# Altium schematic sheet UKU208_power_board.SchDoc
size A3
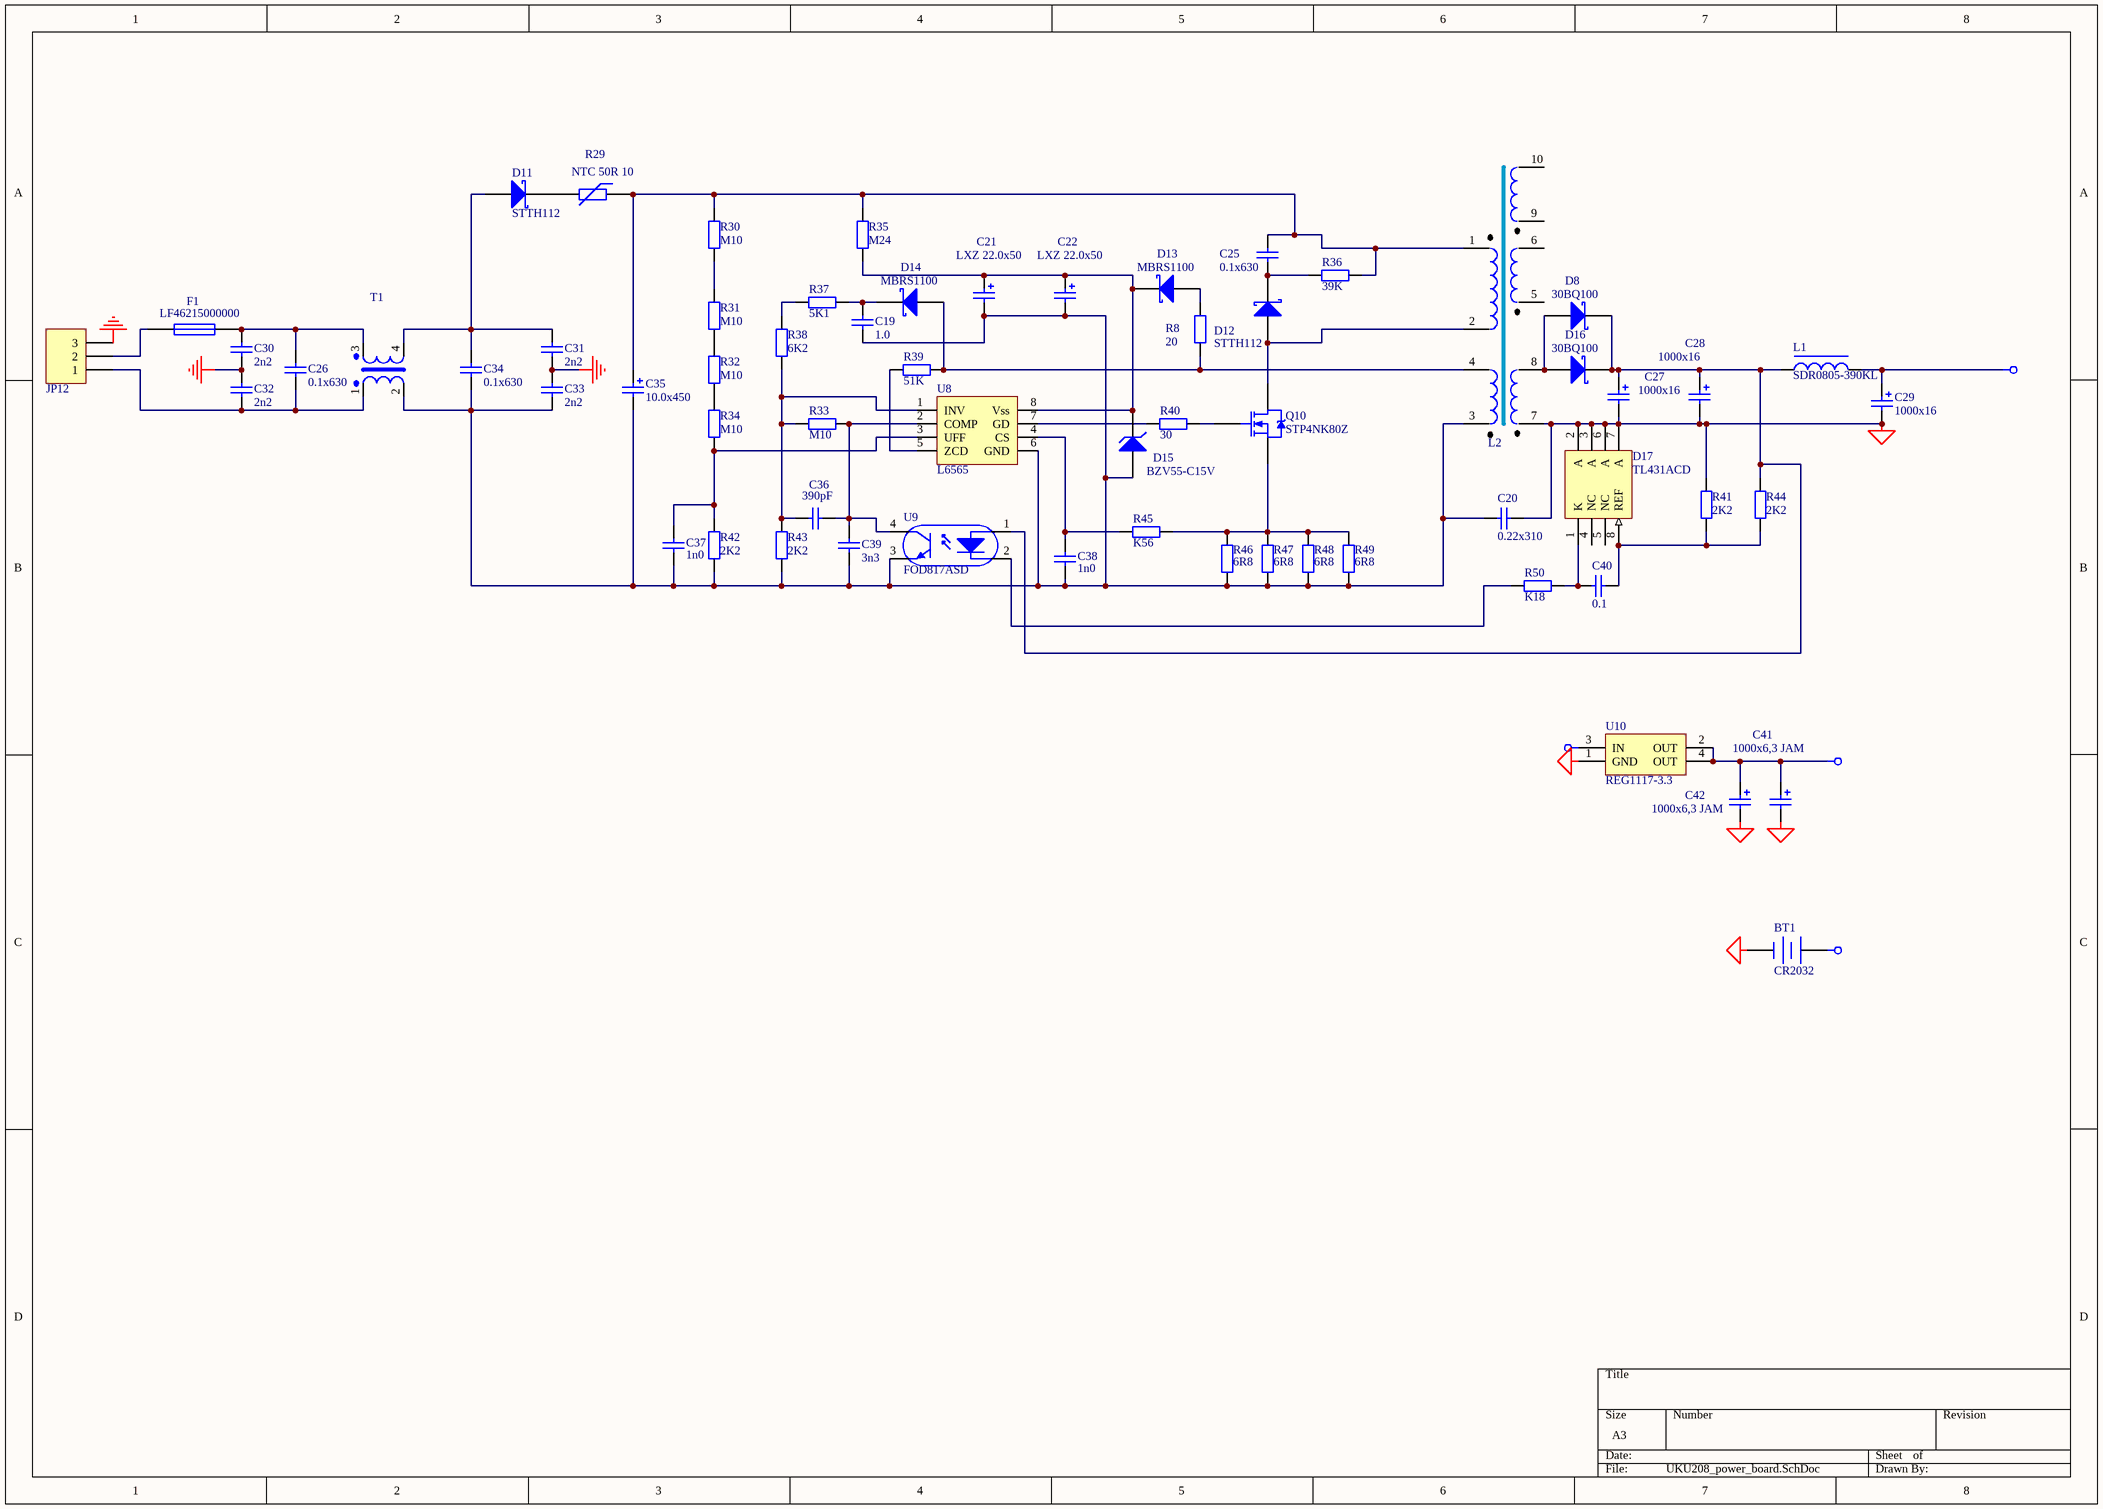
[diagram p0: UKU208_power_board.SchDoc]

## Parts
BT1  CR2032  [BAT_SUPP]
C19  1.0  [_1206]
C20  0.22x310  [C8]
C21  LXZ 22.0x50  [el3]
C22  LXZ 22.0x50  [el3]
C25  0.1x630  [c15]
C26  0.1x630  [c15]
C27  1000x16  [el5]
C28  1000x16  [el5]
C29  1000x16  [el5]
C30  2n2  [C8]
C31  2n2  [c8]
C32  2n2  [c8]
C33  2n2  [c8]
C34  0.1x630  [c15]
C35  10.0x450  [el_15_25_h]
C36  390pF  [_1206]
C37  1n0  [_1206]
C38  1n0  [_1206]
C39  3n3  [_1206]
C40  0.1  [_1206]
C41  1000x6,3 JAM  [el3]
C42  1000x6,3 JAM  [el3]
D8  30BQ100  [30BQ100]
D11  STTH112  [D_6_3]
D12  STTH112  [D_6_3]
D13  MBRS1100  [D_6_3]
D14  MBRS1100  [D_6_3]
D15  BZV55-C15V  [_1206d]
D16  30BQ100  [30BQ100]
D17  TL431ACD  [SO-G8]
F1  LF46215000000  [LF462]
JP12  Header 3  [2EDGR-5.08-3P]  (value not drawn)
L1  SDR0805-390KL  [L10x10]
L2  L220-K10  [trans_ring1]  (value not drawn)
Q10  STP4NK80Z  [TO220_h]
R8  20  [_1206]
R29  NTC 50R 10  [JVR07N]
R30  M10  [_1206]
R31  M10  [_1206]
R32  M10  [_1206]
R33  M10  [_1206]
R34  M10  [_1206]
R35  M24  [AXIAL-0.7]
R36  39K  [AXIAL-0.7]
R37  5K1  [_1206]
R38  6K2  [_1206]
R39  51K  [_1206]
R40  30  [_1206]
R41  2K2  [_1206]
R42  2K2  [_1206]
R43  2K2  [_1206]
R44  2K2  [_1206]
R45  K56  [_1206]
R46  6R8  [_1206]
R47  6R8  [_1206]
R48  6R8  [_1206]
R49  6R8  [_1206]
R50  K18  [_1206]
T1  TRANS1_1  [3030R4]  (value not drawn)
U8  L6565  [so-g8]
U9  FOD817ASD  [FOD817ASD]
U10  REG1117-3.3  [DSO-G3]

## Nets
+3v3: C41.1 C42.1 U10.2(OUT) U10.4(OUT)
+5v: C29.1 L1.2 U10.3(IN)
+Vbat: BT1.1(+)
GND: BT1.2(-) C20.1 C27.2 C28.2 C29.2 C41.2 C42.2 D17.2(A) D17.3(A) D17.6(A) D17.7(A) L2.7 R41.2 U10.1(GND)
GND_GND: C30.1 C31.1 C32.2 C33.2 JP12.3
NetC19_1: C19.1 C20.2 C21.2 C22.2 C33.1 C34.1 C35.2 C37.2 C38.2 C39.1 D15.1(A) L2.3 R42.1 R43.1 R46.2 R47.2 R48.2 R49.2 T1.2(Pri-) U8.6(GND) U9.3
NetC19_2: C19.2 D14.2(K) R37.1
NetC21_1: C21.1 C22.1 D13.2(K) D15.2(K) R35.1 U8.8(Vss)
NetC25_1: C25.1 D12.2(K) R36.2
NetC25_2: C25.2 C35.1 L2.1 R29.1 R30.2 R35.2 R36.1
NetC26_1: C26.1 C32.1 JP12.1 T1.1(Pri+)
NetC26_2: C26.2 C30.2 F1.1 T1.3(Sec1+)
NetC27_1: C27.1 C28.1 D8.2(K) D16.2(K) L1.1 R44.1 U9.1
NetC31_2: C31.2 C34.2 D11.1(A) T1.4(Sec1-)
NetC36_1: C36.1 R33.2 R38.1 R43.2 U8.1(INV)
NetC36_2: C36.2 C39.2 R33.1 U8.2(COMP) U9.4
NetC37_1: C37.1 R34.1 R42.2 U8.3(UFF)
NetC38_1: C38.1 R45.2 U8.4(CS)
NetC40_1: C40.1 D17.8(REF) R41.1 R44.2
NetC40_2: C40.2 D17.1(K) R50.1
NetD8_1: D8.1(A) D16.1(A) L2.8
NetD11_2: D11.2(K) R29.2
NetD12_1: D12.1(A) L2.2 Q10.2(D)
NetD13_1: D13.1(A) R8.1
NetD14_1: D14.1(A) L2.4 R8.2 R39.1
NetF1_2: F1.2 JP12.2
NetQ10_1: Q10.1(G) R40.1
NetQ10_3: Q10.3(S) R45.1 R46.1 R47.1 R48.1 R49.1
NetR30_1: R30.1 R31.2
NetR31_1: R31.1 R32.2
NetR32_1: R32.1 R34.2
NetR37_2: R37.2 R38.2
NetR39_2: R39.2 U8.5(ZCD)
NetR40_2: R40.2 U8.7(GD)
NetR50_2: R50.2 U9.2

Not connected (* = marked no-connect by the designer): D17 4(NC) 5(NC); L2 5 6 9 10

## Library data of the parts
BT1 = Battery: Multicell Battery; Manufacturer: Generic Components; Published: 24-Mar-1999; Revision: July-2002: Re-released for DXP Platform.; Publisher: Altium Limited
C19 C20 C25 C26 C30-C34 C36-C40 = Cap Semi: Capacitor (Semiconductor SIM Model); Manufacturer: Generic Components; Class I: Passive; Value: 1,0; Published: 8-Jun-2000; Revision: July-2002: Re-released for DXP Platform.; Publisher: Altium Limited; Class II: Capacitor
C21 C22 C27-C29 C35 C41 C42 = Cap Pol1: Polarized Capacitor (Radial); Manufacturer: Generic Components; Class I: Passive; Value: 22,0x50; Published: 8-Jun-2000; Revision: July-2002: Re-released for DXP Platform.; Publisher: Altium Limited; Class II: Capacitor
D8 D13 D14 D16 = 10BQ015: Schottky Rectifier; Manufacturer: International Rectifier; Revision 1: 10-July-2000: SIM Model Added.; Revision 2: July-2002: Re-released for DXP Platform.; Class I: Discrete; Class II: Rectifier - Schottky; Published: 8-Jun-2000; Datasheet: Latest Revision: PD-2.396A; Package Reference: DO-214AA; Publisher: Altium Limited
D11 D12 = 10BQ015: Schottky Diode; Manufacturer: International Rectifier; Revision 1: 10-July-2000: SIM Model Added.; Revision 2: July-2002: Re-released for DXP Platform.; Class I: Discrete; Class II: Rectifier - Schottky; Value: 10BQ100; Published: 8-Jun-2000; Datasheet: Latest Revision: PD-2.396A; Package Reference: DO-214AA; Publisher: Altium Limited
D15 = D Zener: Zener Diode; Manufacturer: Generic Components; Class I: Discrete; Class II: Diode - Zener; Value: BZV55C5V6; Published: 8-Jun-2000; Revision: July-2002: Re-released for DXP Platform.; Publisher: Altium Limited
D17 = TL431ACD: Programmable Precision Reference; Manufacturer: Motorola; Class I: Power Management; Class II: Voltage Reference; Published: 15-Apr-2002; Datasheet: Linear and Interface Integrated Circuits, DL128 Rev2 (1988); Package Reference: 751-02; Publisher: Altium Limited
F1 = Fuse 1: Fuse; Manufacturer: Generic Components; Class I: Passive; Published: 8-Jun-2000; Revision: July-2002: Re-released for DXP Platform.; Publisher: Altium Limited; Class II: Fuse
JP12 = Header 3: Header, 3-Pin; Manufacturer: Generic Components; Class I: Connector; Revision: July-2002: Re-released for DXP Platform.; Publisher: Altium Limited
L1 = Inductor Konstr 2: Magnetic-Core Inductor; Manufacturer: Generic Components; Class I: Passive; Published: 24-Mar-1999; Revision: July-2002: Re-released for DXP Platform.; Publisher: Altium Limited; Class II: Inductor
L2 = L1_dc_2: Дроссель
Q10 = NMOS-2: N-Channel Power MOSFET; Manufacturer: Generic Components; Class I: Discrete; Class II: MOSFET - Power; Note: Pin 2 is electrically connected to pin 4.; Published: 8-Jun-2000; Revision: July-2002: Re-released for DXP Platform.; Datasheet: Latest Revision: PD-9.814; Package Reference: TO-220AB; Publisher: Altium Limited
R8 R30-R50 = Res2: Resistor; Manufacturer: Generic Components; Class I: Passive; Value: 1K0; Rule: Undefined; Published: 8-Jun-2000; Revision: July-2002: Re-released for DXP Platform.; Publisher: Altium Limited; Class II: Resistor
R29 = Res Varistor: Varistor (Voltage-Sensitive Resistor); Manufacturer: Generic Components; Class I: Discrete; Published: 24-Mar-1999; Revision: July-2002: Re-released for DXP Platform.; Publisher: Altium Limited; Class II: Voltage-Sensitive Resistor
T1 = TRANS1_1: Manufacturer: Generic Components; Class I: Passive; Class II: Transformer; Published: 25-Jan-2001; Revision: July-2002: Re-released for DXP Platform.; Publisher: Altium Limited
U9 = F00817ASD
U10 = REG1117-3.3: 800mA and 1A Low Dropout Positive Regulator 2.85V, 3.3V, 5V, and Adjustable; Manufacturer: Burr-Brown; Package Information: Latest Revision: Rev. C; Class I: Power Management; Class II: Voltage Regulator; Published: 8-Jun-2000; Revision: July-2002: Re-released for DXP Platform.; Datasheet: Latest Revision: Sep-1997; Package Reference: ZZ311; Publisher: Altium Limited